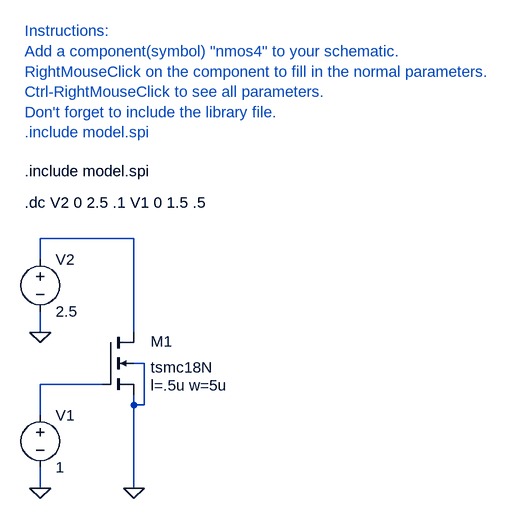
[diagram p0: schematic mos_test.asc]
mos_test.asc, the LTspice schematic file:
Version 4
SHEET 1 880 680
WIRE 32 48 32 16
WIRE 32 160 32 128
WIRE 32 288 32 240
WIRE 32 400 32 368
WIRE 128 240 32 240
WIRE 176 16 32 16
WIRE 176 160 176 16
WIRE 176 272 176 256
WIRE 176 400 176 272
WIRE 192 208 176 208
WIRE 192 272 176 272
WIRE 192 272 192 208
FLAG 176 400 0
FLAG 32 160 0
FLAG 32 400 0
SYMBOL nmos4 128 160 R0
WINDOW 0 74 14 Left 0
WINDOW 3 74 54 Left 0
WINDOW 123 74 82 Left 0
SYMATTR InstName M1
SYMATTR Value tsmc18N
SYMATTR Value2 l=.5u w=5u
SYMBOL voltage 32 32 R0
SYMATTR InstName V2
SYMATTR Value 2.5
SYMBOL voltage 32 272 R0
SYMATTR InstName V1
SYMATTR Value 1
TEXT 8 -40 Left 0 !.dc V2 0 2.5 .1 V1 0 1.5 .5
TEXT 8 -88 Left 0 !.include model.spi
TEXT 8 -304 Left 0 ;Instructions:\nAdd a component(symbol) "nmos4" to your schematic.\nRightMouseClick on the component to fill in the normal parameters.\nCtrl-RightMouseClick to see all parameters. \nDon't forget to include the library file.\n.include model.spi

The netlist it stands for:
* mos_test.asc
M1 N001 N002 0 0 tsmc18N l=.5u w=5u
V2 N001 0 2.5
V1 N002 0 1
.model NMOS NMOS
.model PMOS PMOS
.lib standard.mos
.dc V2 0 2.5 .1 V1 0 1.5 .5
.include model.spi
* Instructions:
* Add a component(symbol) "nmos4" to your schematic.
* RightMouseClick on the component to fill in the normal parameters.
* Ctrl-RightMouseClick to see all parameters.
* Don't forget to include the library file.
* .include model.spi
.backanno
.end